# EAGLE design And_gate_using_Transistor (EAGLE 9.6.2)
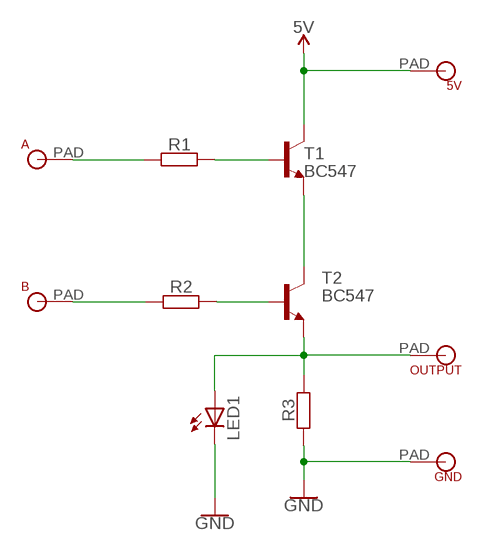
[diagram p0: schematic, sheet 1]

## Parts
5V  MICROBIT_PAD  [MICROBIT_PAD]
A  MICROBIT_PAD  [MICROBIT_PAD]
B  MICROBIT_PAD  [MICROBIT_PAD]
GND  MICROBIT_PAD  [MICROBIT_PAD]
LED1  LED3MM  [LED3MM]
OUTPUT  MICROBIT_PAD  [MICROBIT_PAD]
R1  RESISTOR-07  [R0207/7]
R2  RESISTOR-07  [R0207/7]
R3  RESISTOR-07  [R0207/7]
T1  BC547  [TO92]
T2  BC547  [TO92]

## Nets
5V: 5V.PAD T1.3(C)
GND: GND.PAD LED1.K(C) R3.1
N$1: R2.2 T2.2(B)
N$2: T1.1(E) T2.3(C)
N$3: LED1.A OUTPUT.PAD R3.2 T2.1(E)
N$4: R1.2 T1.2(B)
N$6: A.PAD R1.1
N$7: B.PAD R2.1

## Library data of the parts
5V A B GND OUTPUT = microbit:MICROBIT_PAD
LED1 = adafruit:LED: LED OSRAM: - CHIPLED LG R971, LG N971, LY N971, LG Q971, LY Q971, LO R971, LY R971 LH N974, LH R974 LS Q976, LO Q976, LY Q976 LO Q996 - Hyper CHIPLED LW Q18S LB Q993, LB Q99A, LB R99A - SideLED LS A670, LO A670, LY A670, LG A670, LP A670 LB A673, LV A673, LT A673, LW A673 LH A674 LY A675 LS A676, LA A676, LO A676, LY A676, LW A676 LS A679, LY A679, LG A679 - Hyper Micro SIDELED® LS Y876, LA Y876, LO Y876, LY Y876 LT Y87S - SmartLED LW L88C, LW L88S LB L89C, LB L89S, LG L890 LS L89K, LO L89K, LY L89K LS L896, LA L896, LO L896, LY L896 - TOPLED LS T670, LO T670, LY T670, LG T670, LP T670 LSG T670, LSP T670, LSY T670, LOP T670, LYG T670 LG T671, LOG T671, LSG T671 LB T673, LV T673, LT T673, LW T673 LH T674 LS T676, LA T676, LO T676, LY T676, LB T676, LH T676, LSB T676, LW T676 LB T67C, LV T67C, LT T67C, LS T67K, LO T67K, LY T67K, LW E67C LS E67B, LA E67B, LO E67B, LY E67B, LB E67C, LV E67C, LT E67C LW T67C LS T679, LY T679, LG T679 LS T770, LO T770, LY T770, LG T770, LP T770 LB T773, LV T773, LT T773, LW T773 LH T774 LS E675, LA E675, LY E675, LS T675 LS T776, LA T776, LO T776, LY T776, LB T776 LHGB T686 LT T68C, LB T68C - Hyper Mini TOPLED® LB M676 - Mini TOPLED Santana® LG M470 LS M47K, LO M47K, LY M47K Source: http://www.osram.convergy.de/
R1-R3 = we-rcl:RESISTOR: Resistor all kinds in 0402 and 0603
T1 T2 = transistor-neu-to92:BC547: NPN TRANSISTOR

## Board
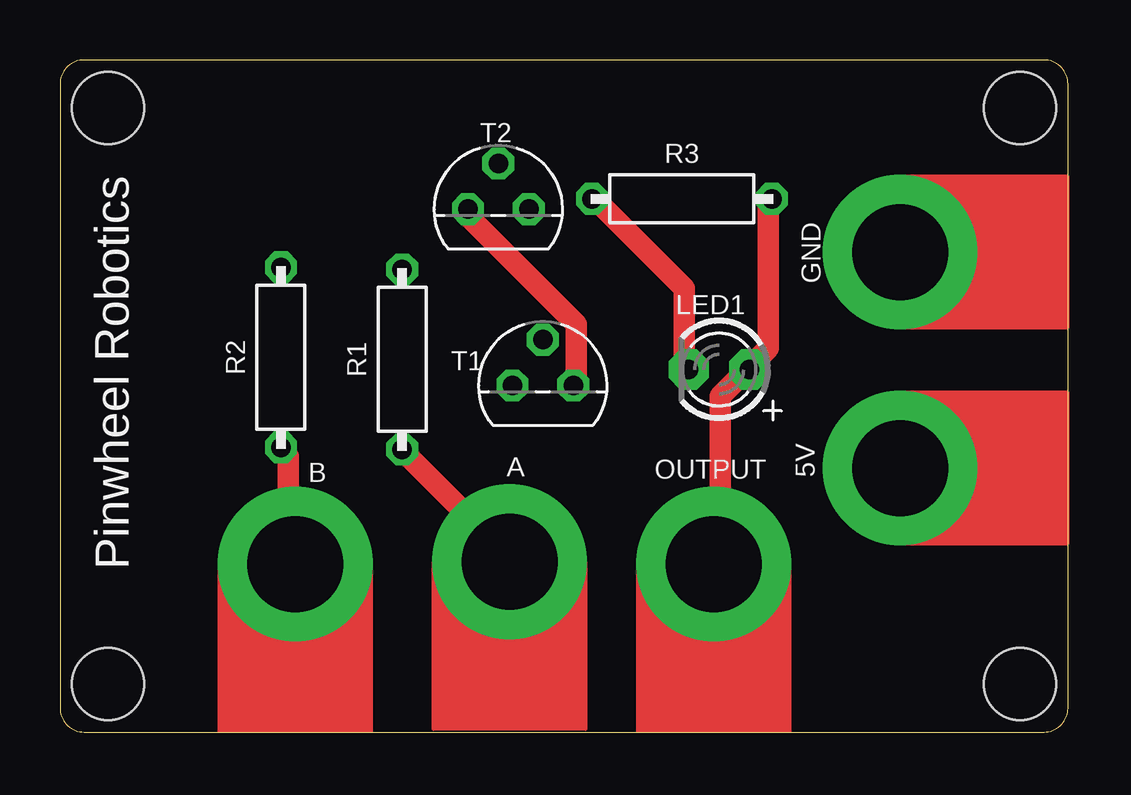
[diagram p1: board, top side]
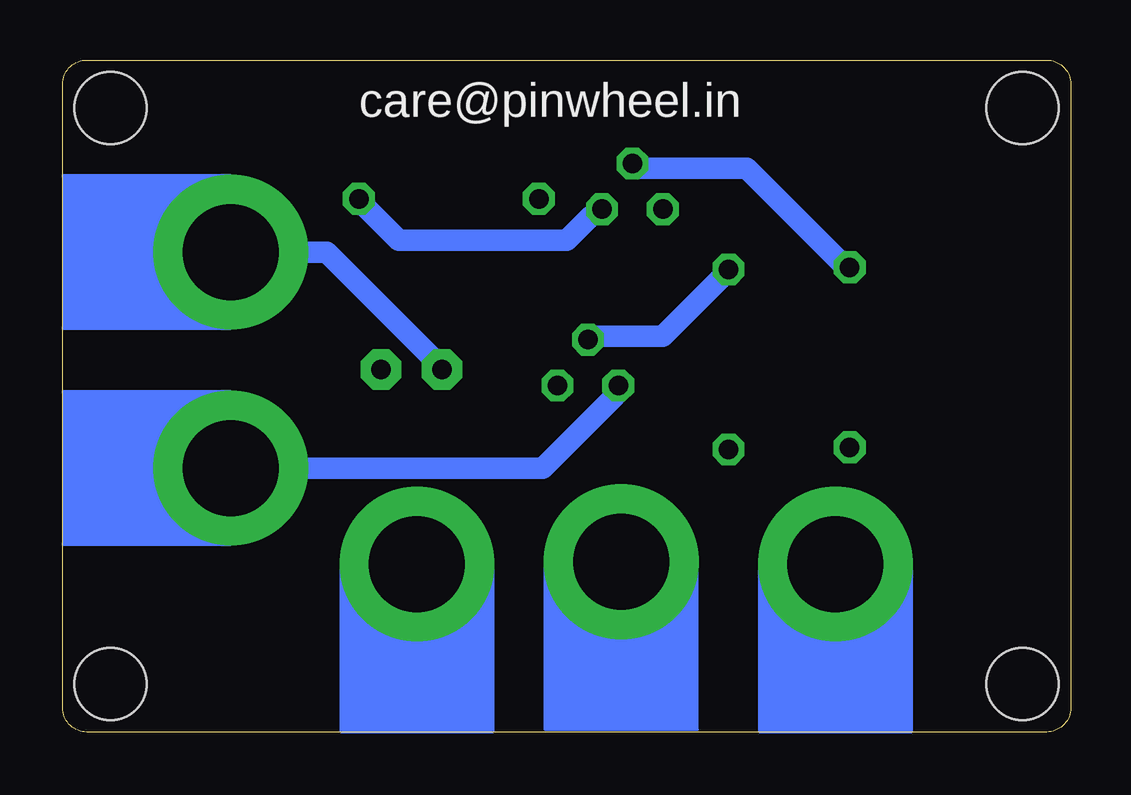
[diagram p2: board, bottom side, seen from below]

Size 42 x 28 mm. Coordinates in mm from the lower left corner, seen from the top.
Outline: 0,27 0,1 arc90 1,0 41,0 arc90 42,1 42,27 arc90 41,28 1,28 arc90 0,27
Copper layers (1*16): Top 0.035mm / dielectric 1.5mm / Bottom 0.035mm
Design rules "default *": minimum track width 35mil, minimum drill 0.35mm, track to track 6mil, track to pad 6mil, pad to pad 6mil, via to via 6mil, smd to smd 6mil, copper to edge 40mil, drill to drill 6mil, minimum pad ring 10mil, minimum via ring 8mil, stop-mask expansion 4mil, vias tented up to drill 0mil, thermal gap 10mil
Holes 3 mm at 2,2 40,2 40,26 2,26

### Footprints (pad centres in the part's own frame; a part is rotated, then mirrored left to right if it is on the bottom)
MICROBIT_PAD = drill 4 pad 6.452: PAD 0,0
LED3MM = drill 0.813 pad 1.676 octagon: A -1.27,0; K 1.27,0
R0207/7 = drill 0.813 octagon: 1 -3.75,0; 2 3.75,0
TO92 = drill 0.813 octagon: 1 1.27,0; 2 0,1.905; 3 -1.27,0

### Placement (x,y rotation side)
5V  35,11 90 top
A  18.73,7.1 0 top
B  9.8,7 0 top
GND  35,20 90 top
LED1  27.46,15.1 180 top
OUTPUT  27.24,7 0 top
R1  14.26,15.53 90 top
R2  9.21,15.61 90 top
R3  25.91,22.21 0 top
T1  20.12,14.44 0 top
T2  18.26,21.78 0 top

### Tracks (layer width: path | path; a pad name or v marks a point on that pad's centre or on a via)
5V
  Bottom 0.889: 5V.PAD 22,11 19,14 T1.3
GND
  Top 0.889: R3.1 22.5,22 26,18.5 26,15.5 LED1.K
  Bottom 0.889: GND.PAD 31,20 26.5,15.5 LED1.K
N$1
  Bottom 0.889: R2.2 9.5,19.5 13.5,23.5 18,23.5 T2.2
N$2
  Top 0.889: T1.1 21.5,14.5 21.5,17 17,21.5 T2.3
N$3
  Top 0.889: R3.2 29.5,22 29.5,16 29,15.5 LED1.A 28.5,15 27.5,14 27.5,7 OUTPUT.PAD
  Bottom 0.889: T2.1 20,21.5 21,20.5 28,20.5 29.5,22 R3.2
N$4
  Bottom 0.889: R1.2 14.5,19 17,16.5 20,16.5 T1.2
N$6
  Top 0.889: R1.1 14.5,11.5 18.5,7.5 A.PAD
N$7
  Top 0.889: R2.1 9.5,11.5 9.5,7 B.PAD

### Text on the board
tPlace: Pinwheel Robotics
bPlace: care@pinwheel.in